# Altium project SectionD_v1.0.PrjPcb
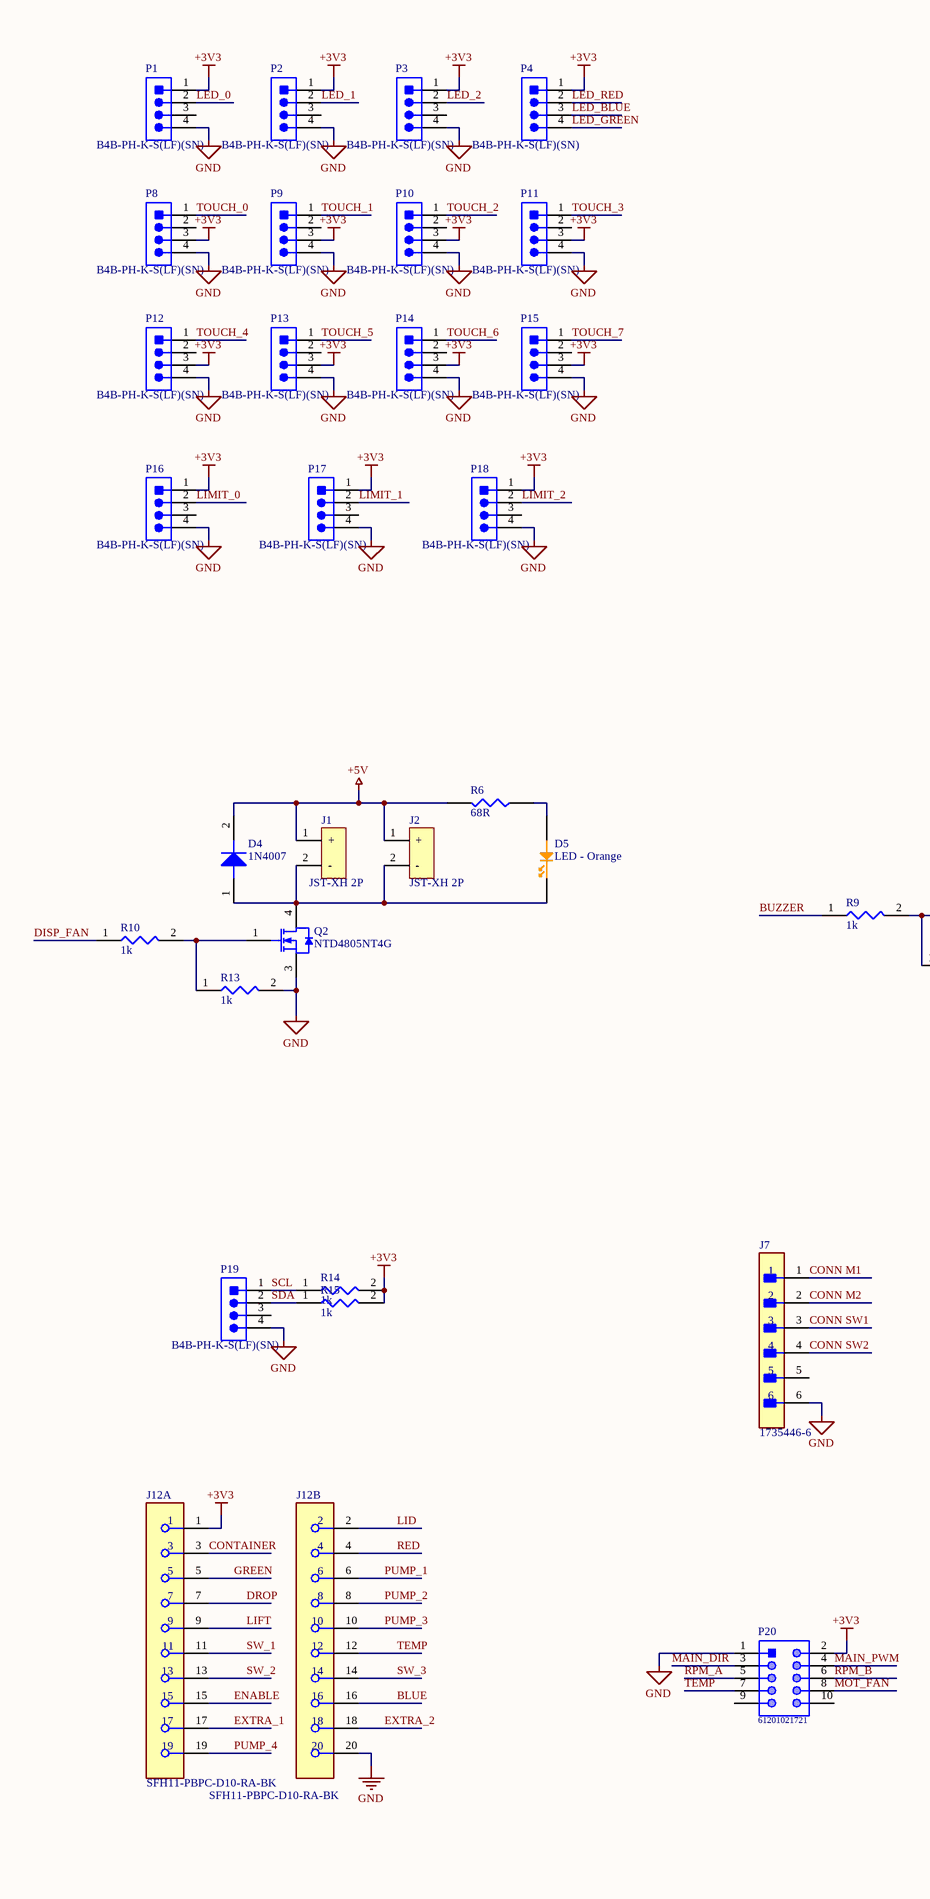
[diagram p0: SectionD_v1.0.SchDoc, left]
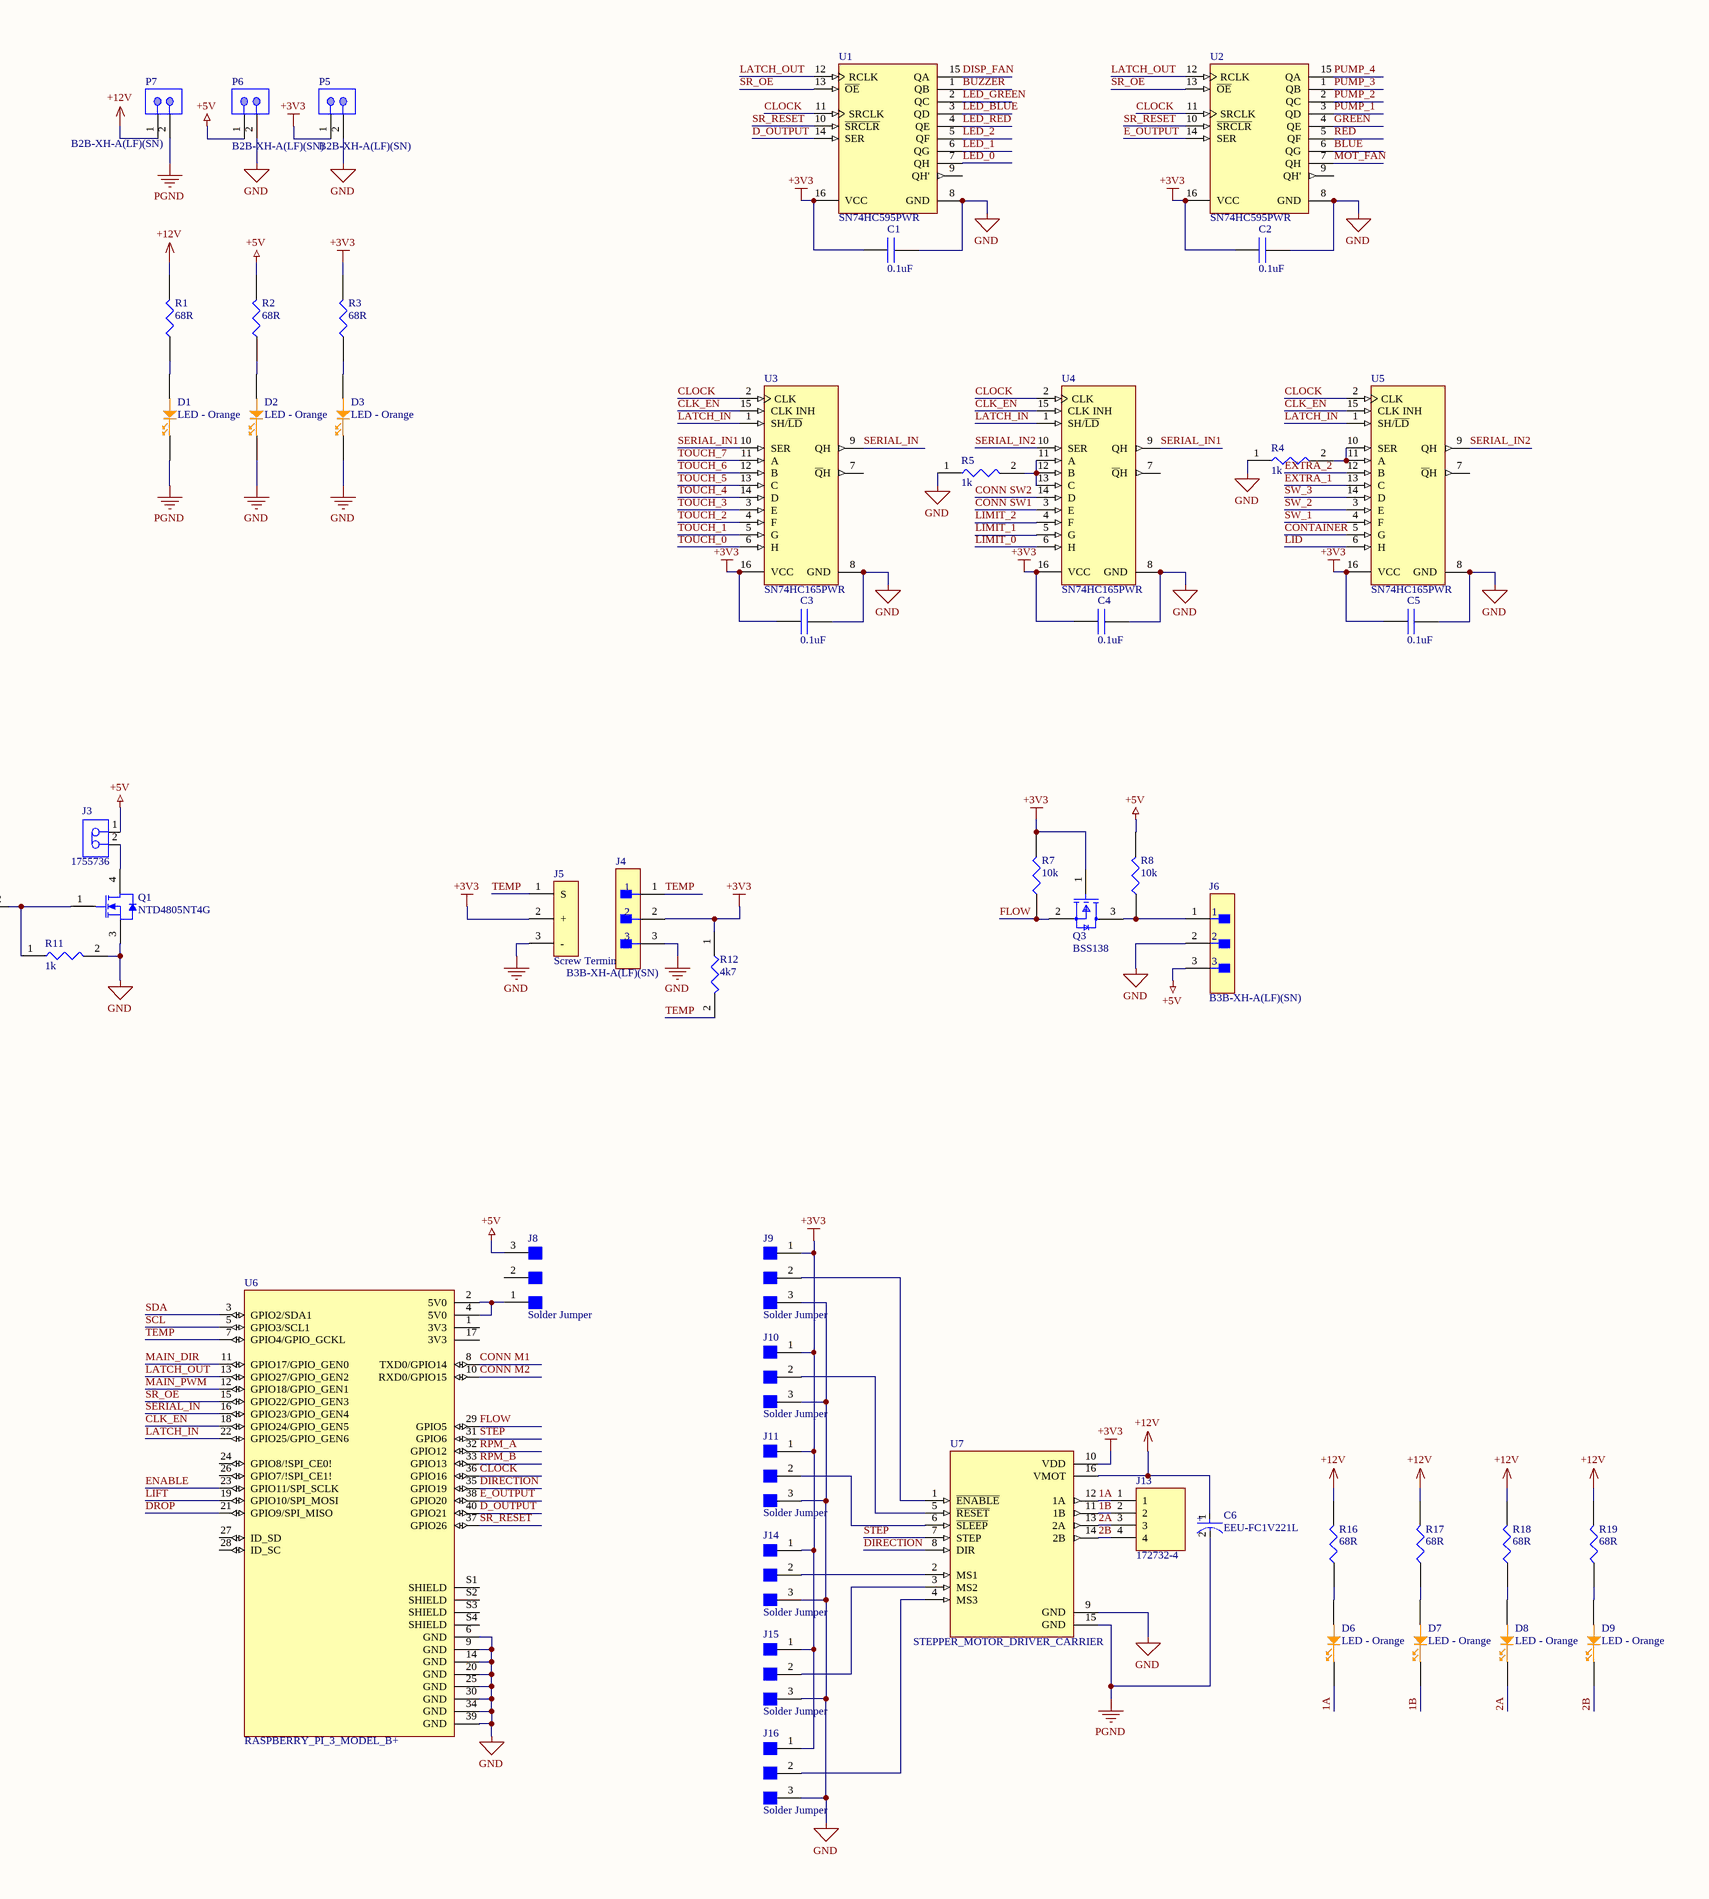
[diagram p1: SectionD_v1.0.SchDoc, right]
1 sheet, 80 parts. Net scope: global (net labels, ports and power ports of the same name join across sheets).
Board file: SectionD_v1.0.PcbDoc

## Sheet SectionD_v1.0.SchDoc
size A2

### Parts
C1  0.1uF  [0.1uF 0603]
C2  0.1uF  [0.1uF 0603]
C3  0.1uF  [0.1uF 0603]
C4  0.1uF  [0.1uF 0603]
C5  0.1uF  [0.1uF 0603]
C6  EEU-FC1V221L  [FP-EEU-FC1V221L-MFG]
D1  LED - Orange  [LED0603-Orange]
D2  LED - Orange  [LED0603-Orange]
D3  LED - Orange  [LED0603-Orange]
D4  1N4007  [M7 1N4007 SMA]
D5  LED - Orange  [LED0603-Orange]
D6  LED - Orange  [LED0603-Orange]
D7  LED - Orange  [LED0603-Orange]
D8  LED - Orange  [LED0603-Orange]
D9  LED - Orange  [LED0603-Orange]
J1  JST-XH 2P  [JST-XH 2P]
J2  JST-XH 2P  [JST-XH 2P]
J3  1755736  [PHOE-1755736-2_V]
J4  B3B-XH-A(LF)(SN)  [FP-B3B-XH-A_LF_SN-MFG]
J5  Screw Terminal  [Screw Terminal 3P 5.08MM]
J6  B3B-XH-A(LF)(SN)  [FP-B3B-XH-A_LF_SN-MFG]
J7  1735446-6  [FP-1735446-6-MFG]
J8  Solder Jumper  [Solder Jumper]
J9  Solder Jumper  [Solder Jumper]
J10  Solder Jumper  [Solder Jumper]
J11  Solder Jumper  [Solder Jumper]
J12  SFH11-PBPC-D10-RA-BK  [FP-SFH11-PBPC-D10-RA-BK-MFG]  (parts A,B of 2)
J13  172732-4  [TE_172732-4]
J14  Solder Jumper  [Solder Jumper]
J15  Solder Jumper  [Solder Jumper]
J16  Solder Jumper  [Solder Jumper]
P1  B4B-PH-K-S(LF)(SN)  [JST-B4B-PH-K-S_V]
P2  B4B-PH-K-S(LF)(SN)  [JST-B4B-PH-K-S_V]
P3  B4B-PH-K-S(LF)(SN)  [JST-B4B-PH-K-S_V]
P4  B4B-PH-K-S(LF)(SN)  [JST-B4B-PH-K-S_V]
P5  B2B-XH-A(LF)(SN)  [JST-B2B-XH-A_V]
P6  B2B-XH-A(LF)(SN)  [JST-B2B-XH-A_V]
P7  B2B-XH-A(LF)(SN)  [JST-B2B-XH-A_V]
P8  B4B-PH-K-S(LF)(SN)  [JST-B4B-PH-K-S_V]
P9  B4B-PH-K-S(LF)(SN)  [JST-B4B-PH-K-S_V]
P10  B4B-PH-K-S(LF)(SN)  [JST-B4B-PH-K-S_V]
P11  B4B-PH-K-S(LF)(SN)  [JST-B4B-PH-K-S_V]
P12  B4B-PH-K-S(LF)(SN)  [JST-B4B-PH-K-S_V]
P13  B4B-PH-K-S(LF)(SN)  [JST-B4B-PH-K-S_V]
P14  B4B-PH-K-S(LF)(SN)  [JST-B4B-PH-K-S_V]
P15  B4B-PH-K-S(LF)(SN)  [JST-B4B-PH-K-S_V]
P16  B4B-PH-K-S(LF)(SN)  [JST-B4B-PH-K-S_V]
P17  B4B-PH-K-S(LF)(SN)  [JST-B4B-PH-K-S_V]
P18  B4B-PH-K-S(LF)(SN)  [JST-B4B-PH-K-S_V]
P19  B4B-PH-K-S(LF)(SN)  [JST-B4B-PH-K-S_V]
P20  61201021721  [61201021721]
Q1  NTD4805NT4G  [ONSC-DPAK-3-369AA-01_V]
Q2  NTD4805NT4G  [ONSC-DPAK-3-369AA-01_V]
Q3  BSS138  [FP-318-08-IPC_B]
R1  68R  [68R 0603]
R2  68R  [68R 0603]
R3  68R  [68R 0603]
R4  1k  [R0603 1k]
R5  1k  [R0603 1k]
R6  68R  [68R 0603]
R7  10k  [10k R0603]
R8  10k  [10k R0603]
R9  1k  [R0603 1k]
R10  1k  [R0603 1k]
R11  1k  [R0603 1k]
R12  4k7  [R0603 1k]
R13  1k  [R0603 1k]
R14  1k  [R0603 1k]
R15  1k  [R0603 1k]
R16  68R  [68R 0603]
R17  68R  [68R 0603]
R18  68R  [68R 0603]
R19  68R  [68R 0603]
U1  SN74HC595PWR  [PW0016A_N]
U2  SN74HC595PWR  [PW0016A_N]
U3  SN74HC165PWR  [PW0016A_N]
U4  SN74HC165PWR  [PW0016A_N]
U5  SN74HC165PWR  [PW0016A_N]
U6  RASPBERRY_PI_3_MODEL_B+  [MODULE_RASPBERRY_PI_3_MODEL_B+]
U7  STEPPER_MOTOR_DRIVER_CARRIER  [MODULE_A4988_STEPPER_MOTOR_DRIVER_CARRIER]

### Nets
+3V3: C1.2 C2.2 C3.2 C4.2 C5.2 J4.2 J5.2(+) J9.1 J10.1 J11.1 J12.1 J14.1 J15.1 J16.1 P1.1 P2.1 P3.1 P4.1 P5.1 P8.3 P9.3 P10.3 P11.3 P12.3 P13.3 P14.3 P15.3 P16.1 P17.1 P18.1 P20.2 Q3.1(G) R3.2 R7.2 R12.1 R14.2 R15.2 U1.16(VCC) U2.16(VCC) U3.16(VCC) U4.16(VCC) U5.16(VCC) U7.10(VDD)
+5V: D4.2(Cathode) J1.1(+) J2.1(+) J3.1 J6.3 J8.3 P6.1 R2.2 R6.2 R8.2
+12V: C6.1(C) P7.1 R1.2 R16.2 R17.2 R18.2 R19.2 U7.16(VMOT)
GND: C1.1 C2.1 C3.1 C4.1 C5.1 D2.1(Cathode) D3.1(Cathode) J4.3 J5.3(-) J6.2 J7.6 J9.3 J10.3 J11.3 J12.20 J14.3 J15.3 J16.3 P1.4 P2.4 P3.4 P5.2 P6.2 P8.4 P9.4 P10.4 P11.4 P12.4 P13.4 P14.4 P15.4 P16.4 P17.4 P18.4 P19.4 P20.1 Q1.3(S) Q2.3(S) R4.1 R5.1 R11.2 R13.2 U1.8(GND) U2.8(GND) U3.8(GND) U4.8(GND) U5.8(GND) U6.6(GND) U6.9(GND) U6.14(GND) U6.20(GND) U6.25(GND) U6.30(GND) U6.34(GND) U6.39(GND) U7.9(GND)
PGND: C6.2(A) D1.1(Cathode) P7.2 U7.15(GND)
1A: D6.1(Cathode) J13.1 U7.12(1A)
1B: D7.1(Cathode) J13.2 U7.11(1B)
2A: D8.1(Cathode) J13.3 U7.13(2A)
2B: D9.1(Cathode) J13.4 U7.14(2B)
BLUE: J12.16 U2.6(QG)
BUZZER: R9.1 U1.1(QB)
CLK_EN: U3.15(CLK_INH) U4.15(CLK_INH) U5.15(CLK_INH) U6.18(GPIO24/GPIO_GEN5)
CLOCK: U1.11(SRCLK) U2.11(SRCLK) U3.2(CLK) U4.2(CLK) U5.2(CLK) U6.36(GPIO16)
CONN M1: J7.1 U6.8(TXD0/GPIO14)
CONN M2: J7.2 U6.10(RXD0/GPIO15)
CONN SW1: J7.3 U4.3(E)
CONN SW2: J7.4 U4.14(D)
CONTAINER: J12.3 U5.5(G)
D_OUTPUT: U1.14(SER) U6.40(GPIO21)
DIRECTION: U6.35(GPIO19) U7.8(DIR)
DISP_FAN: R10.1 U1.15(QA)
DROP: J12.7 U6.21(GPIO9/SPI_MISO)
E_OUTPUT: U2.14(SER) U6.38(GPIO20)
ENABLE: J12.15 U6.23(GPIO11/SPI_SCLK)
EXTRA_1: J12.17 U5.13(C)
EXTRA_2: J12.18 U5.12(B)
FLOW: Q3.2(S) R7.1 U6.29(GPIO5)
GREEN: J12.5 U2.4(QE)
LATCH_IN: U3.1(SH/~{LD}) U4.1(SH/~{LD}) U5.1(SH/~{LD}) U6.22(GPIO25/GPIO_GEN6)
LATCH_OUT: U1.12(RCLK) U2.12(RCLK) U6.13(GPIO27/GPIO_GEN2)
LED_0: P1.2 U1.7(QH)
LED_1: P2.2 U1.6(QG)
LED_2: P3.2 U1.5(QF)
LED_BLUE: P4.3 U1.3(QD)
LED_GREEN: P4.4 U1.2(QC)
LED_RED: P4.2 U1.4(QE)
LID: J12.2 U5.6(H)
LIFT: J12.9 U6.19(GPIO10/SPI_MOSI)
LIMIT_0: P16.2 U4.6(H)
LIMIT_1: P17.2 U4.5(G)
LIMIT_2: P18.2 U4.4(F)
MAIN_DIR: P20.3 U6.11(GPIO17/GPIO_GEN0)
MAIN_PWM: P20.4 U6.12(GPIO18/GPIO_GEN1)
MOT_FAN: P20.8 U2.7(QH)
PUMP_1: J12.6 U2.3(QD)
PUMP_2: J12.8 U2.2(QC)
PUMP_3: J12.10 U2.1(QB)
PUMP_4: J12.19 U2.15(QA)
RED: J12.4 U2.5(QF)
RPM_A: P20.5 U6.32(GPIO12)
RPM_B: P20.6 U6.33(GPIO13)
SCL: P19.1 R14.1 U6.5(GPIO3/SCL1)
SDA: P19.2 R15.1 U6.3(GPIO2/SDA1)
SERIAL_IN: U3.9(QH) U6.16(GPIO23/GPIO_GEN4)
SERIAL_IN1: U3.10(SER) U4.9(QH)
SERIAL_IN2: U4.10(SER) U5.9(QH)
SR_OE: U1.13(~{OE}) U2.13(~{OE}) U6.15(GPIO22/GPIO_GEN3)
SR_RESET: U1.10(~{SRCLR}) U2.10(~{SRCLR}) U6.37(GPIO26)
STEP: U6.31(GPIO6) U7.7(STEP)
SW_1: J12.11 U5.4(F)
SW_2: J12.13 U5.3(E)
SW_3: J12.14 U5.14(D)
TEMP: J4.1 J5.1(S) J12.12 P20.7 R12.2 U6.7(GPIO4/GPIO_GCKL)
TOUCH_0: P8.1 U3.6(H)
TOUCH_1: P9.1 U3.5(G)
TOUCH_2: P10.1 U3.4(F)
TOUCH_3: P11.1 U3.3(E)
TOUCH_4: P12.1 U3.14(D)
TOUCH_5: P13.1 U3.13(C)
TOUCH_6: P14.1 U3.12(B)
TOUCH_7: P15.1 U3.11(A)
NetD1_2: D1.2(Anode) R1.1
NetD2_2: D2.2(Anode) R2.1
NetD3_2: D3.2(Anode) R3.1
NetD4_1: D4.1(Anode) D5.1(Cathode) J1.2(-) J2.2(-) Q2.4(D)
NetD5_2: D5.2(Anode) R6.1
NetD6_2: D6.2(Anode) R16.1
NetD7_2: D7.2(Anode) R17.1
NetD8_2: D8.2(Anode) R18.1
NetD9_2: D9.2(Anode) R19.1
NetJ3_2: J3.2 Q1.4(D)
NetJ6_1: J6.1 Q3.3(D) R8.1
NetJ8_1: J8.1 U6.2(5V0) U6.4(5V0)
NetJ9_2: J9.2 U7.1(~{ENABLE})
NetJ10_2: J10.2 U7.5(~{RESET})
NetJ11_2: J11.2 U7.6(~{SLEEP})
NetJ14_2: J14.2 U7.2(MS1)
NetJ15_2: J15.2 U7.3(MS2)
NetJ16_2: J16.2 U7.4(MS3)
NetQ1_1: Q1.1(G) R9.2 R11.1
NetQ2_1: Q2.1(G) R10.2 R13.1
NetR4_2: R4.2 U5.10(SER) U5.11(A)
NetR5_2: R5.2 U4.11(A) U4.12(B) U4.13(C)

Not connected (* = marked no-connect by the designer): J7 5; J8 2; P1 3; P2 3; P3 3; P8 2; P9 2; P10 2; P11 2; P12 2; P13 2; P14 2; P15 2; P16 3; P17 3; P18 3; P19 3; P20 9 10; U1 9(QH'); U2 9(QH'); U3 7(~{Q}H); U4 7(~{Q}H); U5 7(~{Q}H); U6 1(3V3) 17(3V3) 24(GPIO8/!SPI_CE0!) 26(GPIO7/!SPI_CE1!) 27(ID_SD) 28(ID_SC) S1(SHIELD) S2(SHIELD) S3(SHIELD) S4(SHIELD)

### Notes on the sheet
- (in symbol CMP-05427-000010-1) +

### Library data of the parts
C1-C5 = C0603C104M4RACTU: CAP CER 0.1UF 16V X7R 0603; Manufacturer: KEMET; Dielectric Material: Ceramic; Capacitance: 100nF; Tolerance: 20%; Supplier 1: Digi-Key; Supplier Part Number 1: 399-1099-1-ND; Manufacturer Part Number: C0603C104M4RACTU; RoHS: Yes; Category: Ceramic Capacitors; Stock 1: 114153; Pricing 1: 1=0.10000, 10=0.03100, 50=0.01720, 100=0.01400, 500=0.01002, 1000=0.00787 (USD); Mount: Surface Mount,PCB; Case/Package: 0603; Number of Pins: 2; Case Code (Metric): 1608; Case Code (Imperial): 0603; Min Operating Temperature: -55°C; Max Operating Temperature: 125°C; Package Quantity: 1; Voltage Rating: 16V; Packaging: Tape and Reel; Voltage Rating (DC): 16V; Dielectric: X7R; Termination: SMD/SMT; Length: 1.6mm; Height: 0.8mm; Width: 0.031inch; Thickness: 0.034inch; Lead Pitch: 0.7mm; Depth: 0.8mm; Radiation Hardening: No; REACH SVHC: No SVHC; ComponentLink1URL: https://datasheet.ciiva.com/18102/getdatasheetpartid-66190-18102310.pdf?src-supplier=Verical; ComponentLink1Description: https://datasheet.ciiva.com/18102/getdatasheetpartid-66190-18102310.pdf?src-supplier=Verical; ComponentLink2URL: https://datasheet.ciiva.com/7823/kem-c1002-x7r-smd-7823992.pdf?src-supplier=Element14; ComponentLink2Description: https://datasheet.ciiva.com/7823/kem-c1002-x7r-smd-7823992.pdf?src-supplier=Element14; ComponentLink3URL: https://datasheet.ciiva.com/7823/kem-c1002-x7r-smd-7823993.pdf?src-supplier=Element14; ComponentLink3Description: https://datasheet.ciiva.com/7823/kem-c1002-x7r-smd-7823993.pdf?src-supplier=Element14; ComponentLink4URL: https://datasheet.ciiva.com/14589/70095383-14589450.pdf?src-supplier=Allied+Electronics; ComponentLink4Description: https://datasheet.ciiva.com/14589/70095383-14589450.pdf?src-supplier=Allied+Electronics; ComponentLink5URL: https://datasheet.ciiva.com/18192/getdatasheetpartid-302288-18192716.pdf?src-supplier=Verical; ComponentLink5Description: https://datasheet.ciiva.com/18192/getdatasheetpartid-302288-18192716.pdf?src-supplier=Verical
C6 = CMP-05427-000010-1: CAP ALUM 220UF 20% 35V RADIAL; Manufacturer: Panasonic Electronic Components; Material: Aluminum; Leakage Current: 77uA; Esr: 0.085Ω; Life: 2000Hours; Automotive Grade: Grade 2; Dissipation Factor: 12%; Ripple Current: 730mA; Octopart: https://octopart.com/eeu-fc1v221l-panasonic-39478519; ComponentLink2URL: https://industrial.panasonic.com/cdbs/www-data/pdf/RDF0000/ABA0000C1209.pdf; Package: 0; Height: 16.5mm; Category: Cap; Value: 220uF; ComponentLink2Description: Datasheet; Lead Free: Yes; Device Class L2: Capacitors; Temperature Range High: +105°C; Mouser Description: Capacitor; Aluminum Electrolytic; Fc Radial Elec Cap 220uF 35V; Temperature: -55°C to +105°C; Digikey Description: CAP ALUM 220UF 20% 35V RADIAL; Device Class L3: Aluminum Electrolytic Capacitors; Manufacturer Part Number: EEU-FC1V221L; Device Class L1: Passive Components; Automotive: Yes; RoHS: TRUE; Temperature Range Low: -55°C; Capacitance: 220uF; Voltage Rating: 35V; Tolerance: 20%
D1-D3 D5-D9 = LTST-C191KFKT: LED ORANGE CLEAR SMD; Manufacturer: Vishay Lite-On; Lens Color: Colorless; Wavelength: 611nm; Number of LEDs: 1; Viewing Angle: 130°; Lens Style: Diffused,Colorless,Rectangular; Luminous Intensity: 90mcd; Forward Current: 30mA; Forward Voltage: 2V; Power Rating: 75mW; Reverse Voltage: 5V; Dominant Wavelength: 605nm; Test Current: 20mA; Supplier 1: Digi-Key; Supplier Part Number 1: 160-1445-1-ND; Manufacturer Part Number: LTST-C191KFKT; RoHS: Yes; Category: LEDs; Stock 1: 92562; Pricing 1: 1=0.24000, 10=0.17900, 100=0.08460, 500=0.05640, 1000=0.04418, 2500=0.04324 (USD); Mount: Surface Mount; Case/Package: 0603; Number of Pins: 2; Case Code (Metric): 1608; Color: Orange; Case Code (Imperial): 0603; Min Operating Temperature: -55°C; Max Operating Temperature: 85°C; Package Quantity: 1; Packaging: Tape and Reel; Illumination Color: Orange; Lens Transparency: Clear; Number of Elements: 1; Power Dissipation: 75mW; Length: 1.6mm; Height: 0.55mm; Width: 0.8mm; Depth: 0.8mm; Radiation Hardening: No; Lead Free: Lead Free; ComponentLink1URL: https://datasheet.ciiva.com/2109/ltst-c191kfkt-2109968.pdf?src-supplier=Digi-Key; ComponentLink1Description: https://datasheet.ciiva.com/2109/ltst-c191kfkt-2109968.pdf?src-supplier=Digi-Key; ComponentLink2URL: https://datasheet.ciiva.com/12400/100-ltst-c191kfkt-39904-12400811.pdf?src-supplier=Mouser; ComponentLink2Description: https://datasheet.ciiva.com/12400/100-ltst-c191kfkt-39904-12400811.pdf?src-supplier=Mouser; ComponentLink3URL: https://datasheet.ciiva.com/11775/0900766b80dc02b0-11775613.pdf?src-supplier=RSComponents; ComponentLink3Description: https://datasheet.ciiva.com/11775/0900766b80dc02b0-11775613.pdf?src-supplier=RSComponents; ComponentLink4URL: https://datasheet.ciiva.com/15201/getdatasheetpartid-631075-15201391.pdf?src-supplier=Verical; ComponentLink4Description: https://datasheet.ciiva.com/15201/getdatasheetpartid-631075-15201391.pdf?src-supplier=Verical; ComponentLink5URL: https://datasheet.ciiva.com/2109/s-110-ltst-c191kfkt-2109969.pdf?src-supplier=Digi-Key; ComponentLink5Description: https://datasheet.ciiva.com/2109/s-110-ltst-c191kfkt-2109969.pdf?src-supplier=Digi-Key
D4 = 1N4007FLTR: 1000V 1A Rectifier; Manufacturer: Sangdest Microelectronics; Supplier 1: Digi-Key; Supplier Part Number 1: 1655-1N4007FLCT-ND; Manufacturer Part Number: 1N4007FLTR; RoHS: No; Stock 1: 2517; Pricing 1: 1=0.10000, 10=0.06600, 100=0.03120, 500=0.01848, 1000=0.01241 (USD)
J1 J2 = B2B-XH-A(LF)(SN): JST-XH 2 POS 2.5mm Solder ST Thru-Hole Box; Manufacturer: JST; Number of Positions: 2; Connector Type: Male Pin; Contact Resistance: 20mR; Max Current Rating: 3A; Max Voltage Rating (AC): 250V; Insulation Resistance: 1GR; Wire/Cable Gauge: 22AWG; Supplier 1: Element14; Supplier Part Number 1: 1516276; Manufacturer Part Number: B2B-XH-A(LF)(SN); RoHS: Yes; Category: FFC / FPC; Stock 1: 165899; Mount: Through Hole; Contact Plating: Tin,Copper,Lead; Color: Natural; Contact Material: Brass; Housing Color: White; Housing Material: Polyamide; Min Operating Temperature: -25°C; Max Operating Temperature: 85°C; Number of Rows: 1; Packaging: Bulk; Termination: Solder; Fastening Type: Detent; Orientation: Straight; Current Rating: 3A; Voltage Rating: 250V; Voltage Rating (AC): 250V; Number of Contacts: 2; Max Voltage Rating (DC): 250V; Length: 7.4mm; Pitch: 2.5mm; Depth: 5.75mm; Lead Pitch: 2.5mm; Lead Free: Lead Free; REACH SVHC: No SVHC; ComponentLink1URL: https://datasheet.ciiva.com/26894/getdatasheetpartid-640357-26894434.pdf?src-supplier=Verical; ComponentLink1Description: https://datasheet.ciiva.com/26894/getdatasheetpartid-640357-26894434.pdf?src-supplier=Verical; ComponentLink2URL: https://datasheet.ciiva.com/11746/0900766b8082653e-11746979.pdf?src-supplier=RSComponents; ComponentLink2Description: https://datasheet.ciiva.com/11746/0900766b8082653e-11746979.pdf?src-supplier=RSComponents; ComponentLink3URL: https://datasheet.ciiva.com/26894/getdatasheetpartid-385291-26894760.pdf?src-supplier=Verical; ComponentLink3Description: https://datasheet.ciiva.com/26894/getdatasheetpartid-385291-26894760.pdf?src-supplier=Verical; ComponentLink4URL: https://datasheet.ciiva.com/8052/5448-8052024.pdf?src-supplier=Element14; ComponentLink4Description: https://datasheet.ciiva.com/8052/5448-8052024.pdf?src-supplier=Element14; ComponentLink5URL: https://datasheet.ciiva.com/20207/523653-20207167.pdf?src-supplier=Rapid+Electronics; ComponentLink5Description: https://datasheet.ciiva.com/20207/523653-20207167.pdf?src-supplier=Rapid+Electronics
J3 = CMP-2000-05300-1: Male Header, Pitch 5.08 mm, 1 x 2 Postion, Height 12 mm, Tail Length 3.9 mm, RoHS, Bulk; Manufacturer: Phoenix Contact; Content: 250pc(s); Pitch: 5.08mm; Industrial packaging: Yes; Number of contacts: 2; Manufacturer URL: http://www.phoenixcontact.com/; Datasheet Version: Apr-16; Datasheet URL: http://www.mouser.com/ds/2/324/ItemDetail_1755736-921028.pdf; Manufacturer part No.: 1755736; Type: MSTBVA2,5/2-G-5,08; Colour: Green
J4 J6 = CMP-17439-000014-1: CONN HEADER VERT 3POS 2.5MM; Manufacturer: JST; Conn Gender: Male; Conn Orientation: Vertical; Voltage Rating: 250V; Number Of Contacts: 3; Current Rating: 3A; Contact Material: Tin,Copper; Temperature Range Low: -25°C; Octopart: https://octopart.com/b3b-xh-a%28lf%29%28sn%29-jst-3990185; Device Class L3: unset; Device Class L1: Connectors; Lead Free: Yes; Temperature: -25°C to +85°C; Manufacturer Part Number: B3B-XH-A(LF)(SN); Package: 0; ComponentLink2Description: Datasheet; Pitch: 2.5mm; RoHS: TRUE; Category: Conn; Automotive: No; Temperature Range High: +85°C; Height: 7mm; Device Class L2: Headers and Wire Housings; Number Of Rows: 1; Digikey Description: CONN HEADER VERT 3POS 2.5MM; ComponentLink2URL: https://www.jst-mfg.com/product/pdf/eng/eXH.pdf
J5 = OSTTC032162: TERM BLK 3P SIDE ENT 5.08MM PCB; Manufacturer: On-Shore Technology; Plating: Steel; Number of Levels: 1; Number of Positions Per Level: 3; Current: 15A; Voltage: 300V; Pitch: 0.2inch; Wire Gauge (Max): 22AWG; Wire Gauge (Min): 14AWG; Supplier 1: Digi-Key; Supplier Part Number 1: ED2610-ND; Manufacturer Part Number: OSTTC032162; RoHS: Yes; Category: Terminal Blocks; Stock 1: 3645; Pricing 1: 1=0.85000, 10=0.53000, 25=0.45400, 50=0.40800, 100=0.39950, 250=0.34000, 500=0.32300, 1000=0.28900, 5000=0.22610 (USD); Mount: Through Hole; Contact Plating: Tin; Housing Color: Blue; Color: Blue; Housing Material: Thermoplastic; Contact Material: Brass; Min Operating Temperature: -30°C; Max Operating Temperature: 105°C; Termination: Screw; Number of Contacts: 3; Packaging: Bulk; Number of Rows: 1; Max Current Rating: 15A; Number of Positions: 3; Length: 15.2mm; Height: 10mm; Width: 7.6mm; Lead Free: Lead Free; Flammability Rating: UL94 V-0; ComponentLink1URL: https://datasheet.ciiva.com/823/osttcxx2162-823568.pdf?src-supplier=Digi-Key; ComponentLink1Description: https://datasheet.ciiva.com/823/osttcxx2162-823568.pdf?src-supplier=Digi-Key; ComponentLink2URL: https://datasheet.ciiva.com/19458/2120655-19458972.pdf?src-supplier=Jameco; ComponentLink2Description: https://datasheet.ciiva.com/19458/2120655-19458972.pdf?src-supplier=Jameco
J7 = CMP-03369-000087-1: CONN HEADER VERT 6POS 2MM; Manufacturer: TE; Conn Gender: Male; Conn Orientation: Vertical; Current Rating: 3A; Voltage Rating: 100V; Number Of Contacts: 6; Device Class L1: Connectors; RoHS: TRUE; Pitch: 2mm; Number Of Rows: 1; Device Class L2: Headers and Wire Housings; Digikey Description: CONN HEADER VERT 6POS 2MM; Category: Conn; Automotive: No; Device Class L3: unset; Lead Free: Yes; Package: 1735446-6; Height: 6.37mm; Temperature: -25°C to +85°C; Contact Material: Tin,Nickel; Mouser Description: Headers & Wire Housings 6 POS HDR VERT 2.0mm; Octopart: https://octopart.com/1735446-6-te+connectivity-42205942; Temperature Range High: +85°C; ComponentLink2URL: https://www.te.com/usa-en/product-1735446-6.html; ComponentLink2Description: Datasheet; Temperature Range Low: -25°C; Manufacturer Part Number: 1735446-6
J12 = CMP-25680-000003-1: CONN HDR 20POS 0.1 GOLD PCB R/A; Manufacturer: Sullins; Conn Orientation: Right Angle; Current Rating: 3A; Conn Gender: Female; Number Of Contacts: 20; Pitch: 2.54mm; Is Female: yes; Package: SFH11-PBPC-D10-RA-BK; Number Of Rows: 2; Automotive: No; Footprint Url: https://drawings-pdf.s3.amazonaws.com/11161.pdf; Category: Conn; Temperature Range Low: -40°C; Manufacturer Part Number: SFH11-PBPC-D10-RA-BK; Lead Free: Yes; Octopart: https://octopart.com/sfh11-pbpc-d10-ra-bk-sullins-12270496; Temperature: -40°C to +105°C; Contact Material: Gold,Nickel; ComponentLink2URL: https://s3.amazonaws.com/catalogspreads-pdf/PAGE123%20.100%20SFH11%20SERIES%20FEMALE%20HDR%20ST%20RA.pdf; ComponentLink2Description: Datasheet; Device Class L2: Headers and Wire Housings; Digikey Description: CONN HDR 20POS 0.1 GOLD PCB R/A; Temperature Range High: +105°C; RoHS: TRUE; Device Class L1: Connectors; Device Class L3: unset; Height: 7.2mm
J13 = 172732-4: EIS POST HDR WITH KINK 10P; Package: None; Price: None; Value: *; MP: 172732-4; Availability: Unavailable
P1-P4 P8-P19 = CMP-2000-05165-1: Male Header, Pitch 2 mm, 1 x 4 Position, Height 6 mm, Tail Length 3.4 mm, -25 to 85 degC, RoHS, Bulk; Manufacturer: JST; No of Positions: 4; Style/Orientation: StraightHeader/Plug; Pitch: 2mm; Datasheet URL: http://datasheet.octopart.com/B4B-PH-K-S%28LF%29%28SN%29-JST-datasheet-10558886.pdf; Type: ShroudedHeader; Manufacturer URL: http://www.jst.com/home2.html; Termination: Crimp; Datasheet Version: Apr-09
P5-P7 = CMP-2000-05888-1: Male Header, Pitch 2.5 mm, 1 x 2 Position, Height 7 mm, Tail Length 3.4 mm, -25 to 85 degC, RoHS, Bulk; Manufacturer: JST; No of Positions: 2; Pitch: 2.5mm; Style/Orientation: StraightHeader/Plug; Datasheet Version: 05/2016; Package Description: Male Header, Pitch 2.5 mm, 1 x 2 Position, Height 7 mm, Tail Length 3.4 mm; Package Reference: B2B-XH-A; Mounting Technology: ThroughHole; Type: ShroudedHeader; Datasheet URL: http://www.jst-mfg.com/product/pdf/eng/eXH.pdf; Manufacturer URL: http://www.jst.com/home2.html; Termination: Crimp
P20 = CMP-1502-00021-1: Male Box Header WR-BHD, THT, Angled, pitch 2.54 mm, 10 pins; Manufacturer: Wurth Elektronik; Pin Number: 10; Contact Resistance: 20mOhm; Working Voltage: 250VAC; Pitch: 2.54mm; Withstanding Voltage: 500VAC; Mounting Technology: THT; Publisher: WurthElektronik; Gender: Male; Part Number: 61201021721; Package Reference: 61201021721; Orientation: Angled; Published Date: August2018; Packaging: Tray; Manufacturer URL: http://www.we-online.de; Operating Temperature: -40to125degC; Datasheet URL: https://katalog.we-online.de/em/datasheet/6120xx21721.pdf
Q1 Q2 = CMP-1058-00313-1: Power MOSFET, 30 V, 88 A, Single N-Channel, 3-Pin DPAK, Pb-Free, Tape and Reel; Manufacturer: On Semiconductor; Qrr Typ (nC): 18; Coss Typ (pF): 610; VGS(th) Max (V): 2.5; Channel Polarity: N Channel; Crss Typ (pF): 338; V(BR)DSS Min (V): 30; VGS Max (V): 20; ID Max (A): 88; Ciss Typ (pF): 2865; ComponentLink1Description: Manufacturer URL; Configuration: Single; PackageDescription: 3-Pin Flange Mount, Body 6.54 x 6.095 mm, Pitch 2.29 mm; RoHS: Pb-Free; DatasheetVersion: Rev. 7; Mounting Technology: Surface Mount; PackageVersion: Rev. B, 06/2010; ComponentLink1URL: http://www.onsemi.com/; ComponentLink3Description: Package Specification; ComponentLink2URL: http://www.onsemi.cn/pub_link/Collateral/NTD4805N-D.PDF; Packing: Tape and Reel; Package Type: DPAK-3, IPAK-4; PartNumber: NTD4805NT4G; ComponentLink3URL: http://www.onsemi.cn/pub_link/Collateral/369AA.PDF; PackageReference: DPAK-3-369AA-01; ComponentLink2Description: Datasheet
Q3 = CMP-07173-000101-1: MOSFET N-CH 50V 220MA SOT-23; Turn-Off Delay Time: 20ns; Element Configuration: Single; Rds On Max: 3.5R; Gate to Source Voltage (Vgs): 20V; Threshold Voltage: 1.3V; Number of Elements: 1; Power Dissipation: 360mW; Rise Time: 9ns; Turn-On Delay Time: 2.5ns; Input Capacitance: 27pF; On-State Resistance: 6R; Lead Free: Lead Free; Length: 2.92mm; Width: 1.3mm; Drain to Source Breakdown Voltage: 50V; Min Operating Temperature: -55°C; REACH SVHC: No SVHC; Packaging: Tape and Reel; Radiation Hardening: No; Height: 0.93mm; Drain to Source Voltage (Vdss): 50V; Current Rating: 220mA; Voltage Rating (DC): 50V; Weight: 0.03g; Continuous Drain Current (ID): 220mA; Number of Pins: 3; Nominal Vgs: 1.3V; Max Power Dissipation: 360mW; Fall Time: 9ns; Drain to Source Resistance: 3.5R; Contact Plating: Tin; Case/Package: SOT-23; Package Quantity: 1; Dual Supply Voltage: 50V; Mount: Surface Mount; Termination: SMD/SMT; Max Operating Temperature: 150°C
R1-R3 R6 R16-R19 = CRGP0603F68R: CRGP 0603 68R 1%; Manufacturer: TE Connectivity; Max Power Dissipation: 250mW; Temperature Coefficient: 200ppm/°C; Supplier 1: Digi-Key; Supplier Part Number 1: A130402CT-ND; Manufacturer Part Number: CRGP0603F68R; RoHS: No; Category: Chip SMD Resistors; Stock 1: 49308; Pricing 1: 1=0.14000, 10=0.11400, 100=0.04470, 1000=0.01870, 2500=0.01714 (USD); Case/Package: 0603; Case Code (Imperial): 0603; Case Code (Metric): 1608; Min Operating Temperature: -55°C; Max Operating Temperature: 155°C; Resistor Type: Thick Film; Packaging: Tape and Reel; Resistance: 68R; Tolerance: 1%; Number of Terminations: 2; ComponentLink1URL: https://www.te.com/commerce/DocumentDelivery/DDEController?Action=srchrtrv&amp;DocNm=9-1773463-9&amp;DocType=DS&amp;DocLang=English&src-supplier=Digi-Key; ComponentLink1Description: https://www.te.com/commerce/DocumentDelivery/DDEController?Action=srchrtrv&amp;DocNm=9-1773463-9&amp;DocType=DS&amp;DocLang=English&src-supplier=Digi-Key
R4 R5 R9-R15 = CRGCQ0603F1K0: 0603 1k Ohm 1% 1/10W; Manufacturer: TE Connectivity; Resistance: 1kR; Max Power Dissipation: 100mW; Temperature Coefficient: 100ppm/°C; Supplier 1: Digi-Key; Supplier Part Number 1: A129688CT-ND; Manufacturer Part Number: CRGCQ0603F1K0; RoHS: No; Category: Chip SMD Resistors; Stock 1: 37973; Pricing 1: 1=0.10000, 10=0.02700, 100=0.01090, 1000=0.00490, 2500=0.00426 (USD); Case/Package: 0603; Case Code (Imperial): 0603; Case Code (Metric): 1608; Min Operating Temperature: -55°C; Max Operating Temperature: 155°C; Resistor Type: Thick Film; Features: Moisture Resistant,Automotive AEC-Q200; Packaging: Cut Tape; Tolerance: 1%; Number of Terminations: 2; ComponentLink1URL: https://www.te.com/commerce/DocumentDelivery/DDEController?Action=srchrtrv&DocNm=1773204-3&DocType=DS&DocLang=English&src-supplier=Digi-Key; ComponentLink1Description: https://www.te.com/commerce/DocumentDelivery/DDEController?Action=srchrtrv&DocNm=1773204-3&DocType=DS&DocLang=English&src-supplier=Digi-Key; ComponentLink2URL: https://4donline.ihs.com/images/VipMasterIC/IC/TYEL/TYEL-S-A0004929575/TYEL-S-A0004929575-1.pdf?hkey=52A5661711E402568146F3353EA87419&src-supplier=Farnell; ComponentLink2Description: https://4donline.ihs.com/images/VipMasterIC/IC/TYEL/TYEL-S-A0004929575/TYEL-S-A0004929575-1.pdf?hkey=52A5661711E402568146F3353EA87419&src-supplier=Farnell; ComponentLink3URL: https://www.te.com/commerce/DocumentDelivery/DDEController?Action=srchrtrv&amp;DocNm=1773204-3&amp;DocType=DS&amp;DocLang=English&src-supplier=Digi-Key; ComponentLink3Description: https://www.te.com/commerce/DocumentDelivery/DDEController?Action=srchrtrv&amp;DocNm=1773204-3&amp;DocType=DS&amp;DocLang=English&src-supplier=Digi-Key; ComponentLink4URL: https://4donline.ihs.com/images/VipMasterIC/IC/TYEL/TYEL-S-A0004929575/TYEL-S-A0004929575-1.pdf?hkey=52A5661711E402568146F3353EA87419&src-supplier=Element14; ComponentLink4Description: https://4donline.ihs.com/images/VipMasterIC/IC/TYEL/TYEL-S-A0004929575/TYEL-S-A0004929575-1.pdf?hkey=52A5661711E402568146F3353EA87419&src-supplier=Element14; ComponentLink5URL: https://4donline.ihs.com/images/VipMasterIC/IC/TYEL/TYEL-S-A0004929575/TYEL-S-A0004929575-1.pdf?hkey=52A5661711E402568146F3353EA87419&src-supplier=Newark; ComponentLink5Description: https://4donline.ihs.com/images/VipMasterIC/IC/TYEL/TYEL-S-A0004929575/TYEL-S-A0004929575-1.pdf?hkey=52A5661711E402568146F3353EA87419&src-supplier=Newark
R7 R8 = CRG0603F10K/10: RES 10.0K OHM 1/10W 1% 0603; Manufacturer: TE Connectivity; Voltage Rating: 50V; Number of Resistors: 1; Resistance: 10kR; Power Rating: 100mW; Temperature Coefficient: 100ppm/°C; Supplier 1: Digi-Key; Supplier Part Number 1: A121523CT-ND; Manufacturer Part Number: CRG0603F10K/10; RoHS: Yes; Category: Chip SMD Resistors; Stock 1: 172089; Pricing 1: 1=0.10000, 10=0.03100, 100=0.01270, 1000=0.00570, 2500=0.00494, 5000=0.00409 (USD); Mount: Surface Mount; Case/Package: 0603; Weight: 7.1E-05oz; Case Code (Imperial): 0603; Min Operating Temperature: -55°C; Max Operating Temperature: 125°C; Resistor Type: Thick Film; Number of Terminations: 2; Termination: Solder; Packaging: Tape and Reel; Tolerance: 1%; Package Quantity: 10000; Max Power Dissipation: 100mW; Length: 1.6mm; Height: 0.022inch; Depth: 0.8mm; Width: 0.8mm; Radiation Hardening: No; Military Standard: Not; ELV: Compliant; ComponentLink1URL: https://datasheet.ciiva.com/2530/eng-cd-1622829-ba-2530062.pdf?src-supplier=Digi-Key; ComponentLink1Description: https://datasheet.ciiva.com/2530/eng-cd-1622829-ba-2530062.pdf?src-supplier=Digi-Key
U1 U2 = CMP-0780-00192-3: 8-Bit Shift Registers With 3-State Output Registers, PW0016A, LARGE T&R; Manufacturer: Texas Instruments; VCC(Max)(V): 6; Bits: 8; Output Type: CMOS; 3-State Output: Yes; Output Drive (IOL/IOH)(Max)(mA): 7.8/-7.8; VCC(Min)(V): 2; Rating: Military; tpd @ Nom Voltage(Max)(ns): 34; ICC @ Nom Voltage(Max)(mA): 0.08; Technology Family: HC; F @ Nom Voltage(Max)(Mhz): 28; PackageReference: PW0016A; Generic Part Number: SN74HC595; Operating Temperature Range(C): -40 to 85; PackageVersion: http://www.ti.com/lit/ml/mpds361/mpds361.pdf; Code_JEDEC: MO-153; DatasheetVersion: SCLS041H; Voltage(Nom)(V): 6; Input Type: CMOS
U3-U5 = CMP-0780-00188-3: 8-Bit Parallel-Load Shift Registers, PW0016A, LARGE T&R; Manufacturer: Texas Instruments; ICC @ Nom Voltage(Max)(mA): 0.08; Output Drive (IOL/IOH)(Max)(mA): 5.2/-5.2; tpd @ Nom Voltage(Max)(ns): 38; Rating: Catalog; Voltage(Nom)(V): 6; F @ Nom Voltage(Max)(Mhz): 28; Technology Family: HC; Output Type: CMOS; 3-State Output: No; VCC(Min)(V): 2; Bits: 4; DatasheetVersion: SCLS116G; Generic Part Number: SN74HC165; PackageReference: PW0016A; Code_JEDEC: MO-153; Input Type: CMOS; Operating Temperature Range(C): -40 to 125; VCC(Max)(V): 6; PackageVersion: http://www.ti.com/lit/ml/mpds361/mpds361.pdf
U6 = RASPBERRY_PI_3_MODEL_B+: BCM2837B0 Raspberry Pi 3 Model B+ - ARMÂ® CortexÂ®-A53, VideoCore MPU Embedded Evaluation Board; MP: RASPBERRY PI 3 MODEL B+; SnapEDA_Link: https://www.snapeda.com/parts/RASPBERRY%20PI%203%20MODEL%20B+/Raspberry%20Pi/view-part/4299836/?ref=snap; Package: Raspberry Pi; MF: Raspberry Pi; Value: *; Digi-Key_Part_Number: 1690-1025-ND; Check_prices: https://www.snapeda.com/parts/RASPBERRY%20PI%203%20MODEL%20B+/Raspberry%20Pi/view-part/4299836/?ref=eda
U7 = A4988_STEPPER_MOTOR_DRIVER_CARRIER: Stepper Motor Driver; MP: A4988 STEPPER MOTOR DRIVER CARRIER; MF: Pololu; Availability: Unavailable; Price: None; Package: None; Value: *; SnapEDA_Link: https://www.snapeda.com/parts/A4988%20STEPPER%20MOTOR%20DRIVER%20CARRIER/Pololu/view-part/1499394/?ref=snap